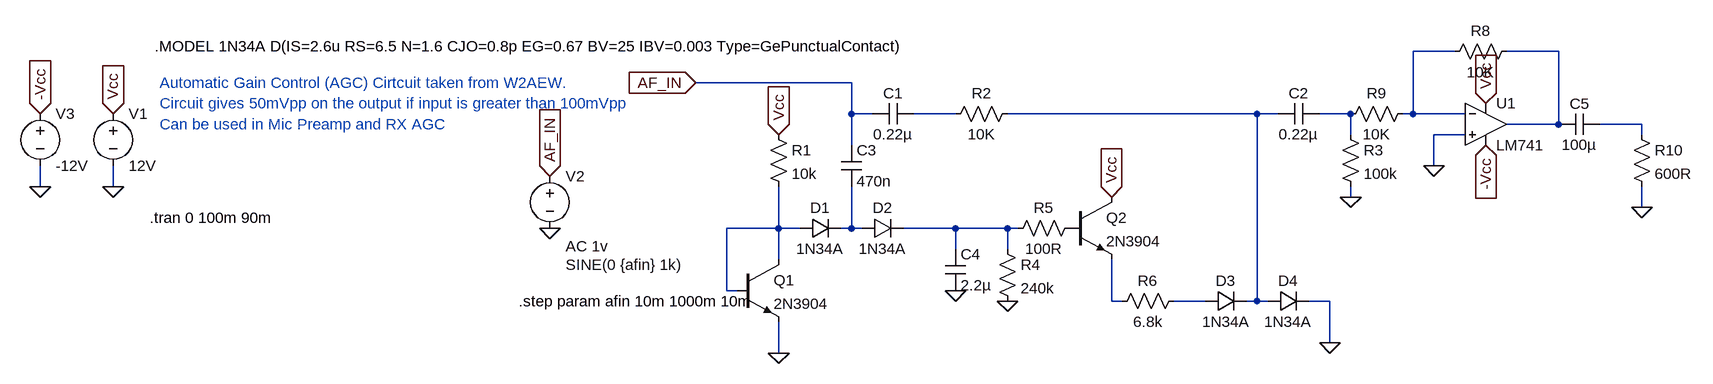
[diagram p0: schematic AGC.asc]
AGC.asc, the LTspice schematic file:
Version 4
SHEET 1 1888 680
WIRE 1280 -144 1216 -144
WIRE 1440 -144 1360 -144
WIRE 352 -96 112 -96
WIRE 352 -48 352 -96
WIRE 384 -48 352 -48
WIRE 512 -48 448 -48
WIRE 976 -48 592 -48
WIRE 1008 -48 976 -48
WIRE 1120 -48 1072 -48
WIRE 1216 -48 1216 -144
WIRE 1216 -48 1200 -48
WIRE 1296 -48 1216 -48
WIRE 1440 -32 1440 -144
WIRE 1440 -32 1360 -32
WIRE 1568 -32 1504 -32
WIRE 1120 -16 1120 -48
WIRE 1296 -16 1248 -16
WIRE 1568 -16 1568 -32
WIRE 352 0 352 -48
WIRE 1248 32 1248 -16
WIRE -896 64 -896 32
WIRE -784 64 -784 32
WIRE 1120 80 1120 64
WIRE 1568 96 1568 64
WIRE 240 128 240 64
WIRE 240 128 160 128
WIRE 272 128 240 128
WIRE 352 128 352 64
WIRE 352 128 336 128
WIRE 368 128 352 128
WIRE 512 128 432 128
WIRE 592 128 512 128
WIRE 608 128 592 128
WIRE 512 160 512 128
WIRE 592 160 592 128
WIRE 240 176 240 128
WIRE 160 224 160 128
WIRE 176 224 160 224
WIRE 752 240 752 176
WIRE 768 240 752 240
WIRE 896 240 848 240
WIRE 976 240 976 -48
WIRE 976 240 960 240
WIRE 992 240 976 240
WIRE 1088 240 1056 240
WIRE 1088 304 1088 240
WIRE 240 320 240 272
FLAG -784 64 0
FLAG -784 -48 Vcc
IOPIN -784 -48 In
FLAG 240 -16 Vcc
IOPIN 240 -16 In
FLAG 240 320 0
FLAG 512 224 0
FLAG 592 240 0
FLAG 752 80 Vcc
IOPIN 752 80 In
FLAG 1088 304 0
FLAG -112 48 AF_IN
IOPIN -112 48 In
FLAG -112 128 0
FLAG 1248 32 0
FLAG 1328 -64 Vcc
IOPIN 1328 -64 In
FLAG 1120 80 0
FLAG 1328 0 -Vcc
IOPIN 1328 0 In
FLAG 1568 96 0
FLAG 112 -96 AF_IN
IOPIN 112 -96 In
FLAG -896 64 0
FLAG -896 -48 -Vcc
IOPIN -896 -48 In
SYMBOL voltage -784 -64 R0
WINDOW 123 0 0 Left 0
WINDOW 39 0 0 Left 0
SYMATTR InstName V1
SYMATTR Value 12V
SYMBOL cap 448 -64 R90
WINDOW 0 0 32 VBottom 2
WINDOW 3 32 32 VTop 2
SYMATTR InstName C1
SYMATTR Value 0.22µ
SYMBOL cap 336 0 R0
SYMATTR InstName C3
SYMATTR Value 470n
SYMBOL res 224 -32 R0
SYMATTR InstName R1
SYMATTR Value 10k
SYMBOL npn 176 176 R0
SYMATTR InstName Q1
SYMATTR Value 2N3904
SYMBOL res 608 -64 R90
WINDOW 0 0 56 VBottom 2
WINDOW 3 32 56 VTop 2
SYMATTR InstName R2
SYMATTR Value 10K
SYMBOL cap 496 160 R0
SYMATTR InstName C4
SYMATTR Value 2.2µ
SYMBOL res 576 144 R0
SYMATTR InstName R4
SYMATTR Value 240k
SYMBOL npn 688 80 R0
SYMATTR InstName Q2
SYMATTR Value 2N3904
SYMBOL res 704 112 R90
WINDOW 0 0 56 VBottom 2
WINDOW 3 32 56 VTop 2
SYMATTR InstName R5
SYMATTR Value 100R
SYMBOL res 864 224 R90
WINDOW 0 0 56 VBottom 2
WINDOW 3 32 56 VTop 2
SYMATTR InstName R6
SYMATTR Value 6.8k
SYMBOL diode 272 144 R270
WINDOW 0 32 32 VTop 2
WINDOW 3 0 32 VBottom 2
SYMATTR InstName D1
SYMATTR Value 1N34A
SYMBOL diode 368 144 R270
WINDOW 0 32 32 VTop 2
WINDOW 3 0 32 VBottom 2
SYMATTR InstName D2
SYMATTR Value 1N34A
SYMBOL diode 896 256 R270
WINDOW 0 32 32 VTop 2
WINDOW 3 0 32 VBottom 2
SYMATTR InstName D3
SYMATTR Value 1N34A
SYMBOL diode 992 256 R270
WINDOW 0 32 32 VTop 2
WINDOW 3 0 32 VBottom 2
SYMATTR InstName D4
SYMATTR Value 1N34A
SYMBOL voltage -112 32 R0
WINDOW 123 24 124 Left 2
WINDOW 39 0 0 Left 0
WINDOW 3 24 152 Left 2
SYMATTR Value2 AC 1v
SYMATTR Value SINE(0 {afin} 1k)
SYMATTR InstName V2
SYMBOL LM\ Opamps\\LM741 1328 -96 R0
SYMATTR InstName U1
SYMBOL res 1376 -160 R90
WINDOW 0 0 56 VBottom 2
WINDOW 3 32 56 VTop 2
SYMATTR InstName R8
SYMATTR Value 10K
SYMBOL cap 1072 -64 R90
WINDOW 0 0 32 VBottom 2
WINDOW 3 32 32 VTop 2
SYMATTR InstName C2
SYMATTR Value 0.22µ
SYMBOL res 1104 -32 R0
SYMATTR InstName R3
SYMATTR Value 100k
SYMBOL res 1216 -64 R90
WINDOW 0 0 56 VBottom 2
WINDOW 3 32 56 VTop 2
SYMATTR InstName R9
SYMATTR Value 10K
SYMBOL cap 1504 -48 R90
WINDOW 0 0 32 VBottom 2
WINDOW 3 32 32 VTop 2
SYMATTR InstName C5
SYMATTR Value 100µ
SYMBOL res 1552 -32 R0
SYMATTR InstName R10
SYMATTR Value 600R
SYMBOL voltage -896 -64 R0
WINDOW 123 0 0 Left 0
WINDOW 39 0 0 Left 0
SYMATTR InstName V3
SYMATTR Value -12V
TEXT -728 112 Left 2 !.tran 0 100m 90m
TEXT -720 -152 Left 2 !.MODEL 1N34A D(IS=2.6u RS=6.5 N=1.6 CJO=0.8p EG=0.67 BV=25 IBV=0.003 Type=GePunctualContact)
TEXT -712 -96 Left 2 ;Automatic Gain Control (AGC) Cirtcuit taken from W2AEW.
TEXT -712 -64 Left 2 ;Circuit gives 50mVpp on the output if input is greater than 100mVpp
TEXT -712 -32 Left 2 ;Can be used in Mic Preamp and RX AGC
TEXT -160 240 Left 2 !.step param afin 10m 1000m 10m

The netlist it stands for:
* AGC.asc
V1 Vcc 0 12V
C1 N003 AF_IN 0.22µ
C3 AF_IN N008 470n
R1 Vcc N007 10k
Q1 N007 N007 0 0 2N3904
R2 N004 N003 10K
C4 N009 0 2.2µ
R4 N009 0 240k
Q2 Vcc P001 N010 0 2N3904
R5 P001 N009 100R
R6 N011 N010 6.8k
D1 N007 N008 1N34A
D2 N008 N009 1N34A
D3 N011 N004 1N34A
D4 N004 0 1N34A
V2 AF_IN 0 SINE(0 {afin} 1k) AC 1v
XU1 0 N001 Vcc -Vcc N002 LM741  ; pins In+ In- V+ V- OUT
R8 N002 N001 10K
C2 N005 N004 0.22µ
R3 N005 0 100k
R9 N001 N005 10K
C5 N006 N002 100µ
R10 N006 0 600R
V3 -Vcc 0 -12V
.model D D
.lib standard.dio
.model NPN NPN
.model PNP PNP
.lib standard.bjt
.tran 0 100m 90m
.MODEL 1N34A D(IS=2.6u RS=6.5 N=1.6 CJO=0.8p EG=0.67 BV=25 IBV=0.003 Type=GePunctualContact)
* Automatic Gain Control (AGC) Cirtcuit taken from W2AEW.
* Circuit gives 50mVpp on the output if input is greater than 100mVpp
* Can be used in Mic Preamp and RX AGC
.step param afin 10m 1000m 10m
.lib LM741.lib
.backanno
.end